# Altium schematic sheet Cells.SchDoc
size 190 x 114 mm
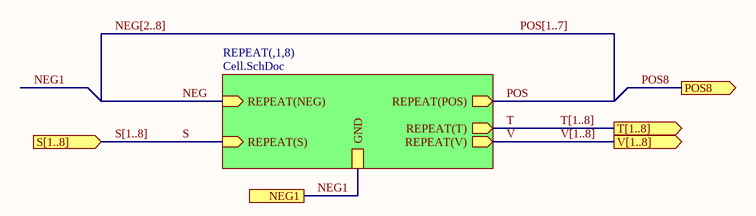
[diagram p0: Cells.SchDoc]

## Sub-sheets
REPEAT(,1,8) = Cell.SchDoc: REPEAT(NEG) (in), REPEAT(POS) (out), REPEAT(T) (out), REPEAT(V) (out), REPEAT(S) (in), GND

## Ports
NEG1, POS8 (out), S[1..8] (in), T[1..8] (out), V[1..8] (out)

## Nets
NEG: sheet REPEAT(,1,8)/REPEAT(NEG)
NEG1: port NEG1, sheet REPEAT(,1,8)/GND
POS: sheet REPEAT(,1,8)/REPEAT(POS)
POS8: port POS8
S: sheet REPEAT(,1,8)/REPEAT(S)
T: sheet REPEAT(,1,8)/REPEAT(T)
V: sheet REPEAT(,1,8)/REPEAT(V)

## Buses and harness runs
bus NEG[2..8] = POS[1..7]
bus S[1..8] = port S[1..8]
bus T[1..8] = port T[1..8]
bus V[1..8] = port V[1..8]